# Altium project PCB_Project1.PrjPCB
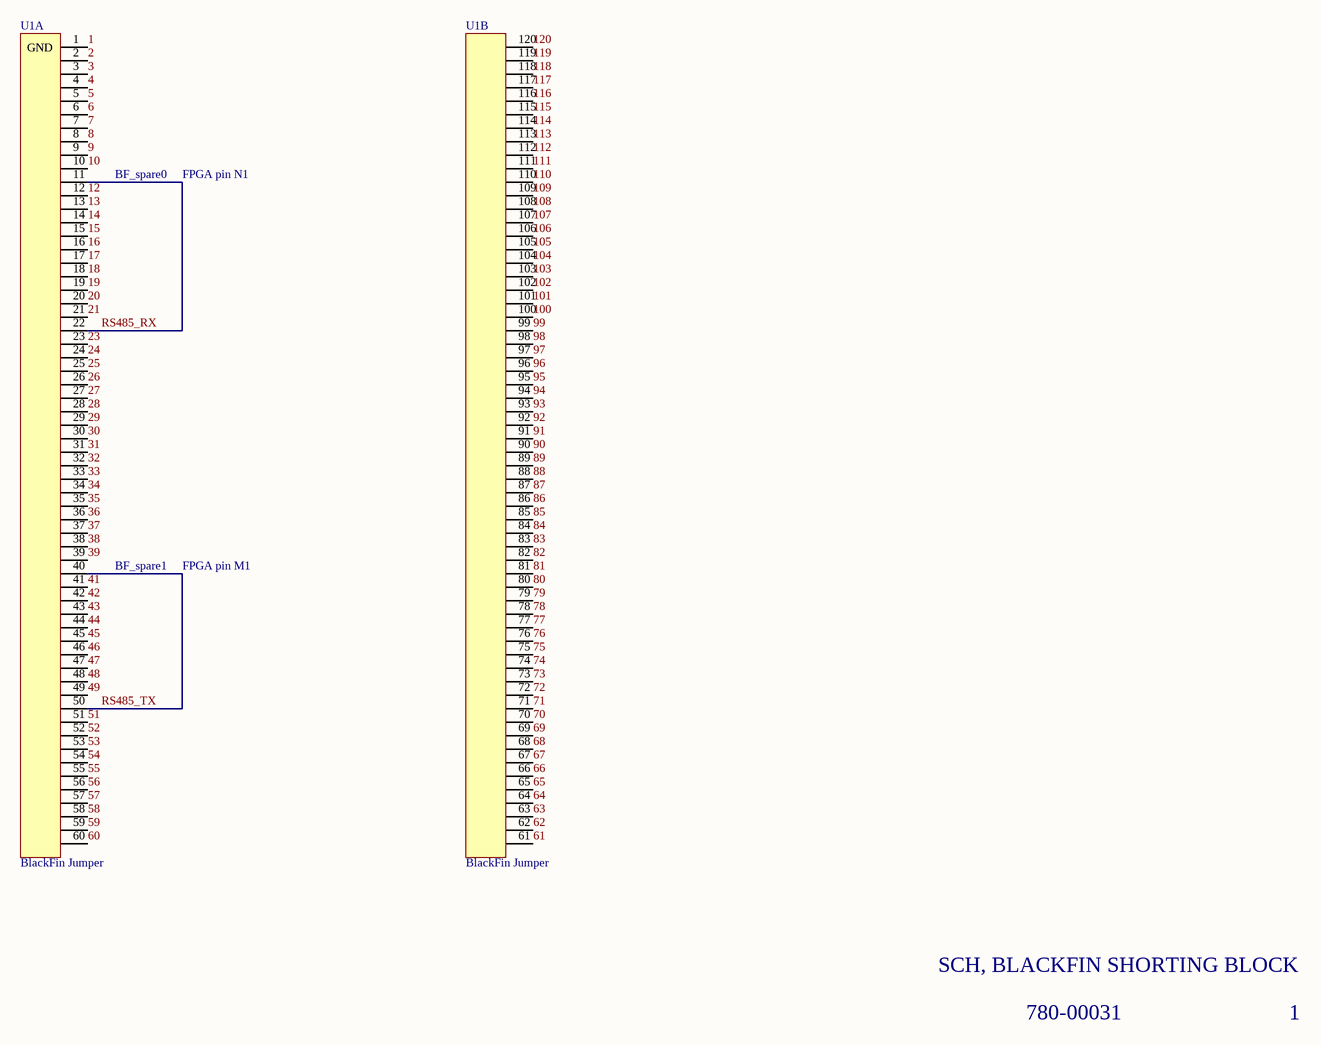
[diagram p0: 780-00031, rev1, BlackFin Shorting Block.SchDoc]
1 sheet, 1 parts. Net scope: global (net labels, ports and power ports of the same name join across sheets).
Board file: 175-00026, rev1, BlackFin Shorting Block.PcbDoc

## Sheet 780-00031, rev1, BlackFin Shorting Block.SchDoc
size B; PageSetup: Record=PageOptions|CenterHorizontal=True|CenterVertical=True|PrintScale=1.09|XCorrection=1.00|YCorrection=1.00|PrintKind=0|BorderSize=5000000|LeftOffset=0|BottomOffset=0|Orientation=2|PaperLength=1000|PaperWidth=1000|Scale=100|PaperSource=7|PrintQuality=-4|MediaType=1|DitherType=10|PaperKind=Tabloid 11 x 17in|PrintScaleMode=1

### Parts
U1  BlackFin Jumper  [CM-BF5xx - Shorting Block]  (parts A,B of 2)

### Nets
1: U1.1(GND)
2: U1.2
3: U1.3
4: U1.4
5: U1.5
6: U1.6
7: U1.7
8: U1.8
9: U1.9
10: U1.10
12: U1.12
13: U1.13
14: U1.14
15: U1.15
16: U1.16
17: U1.17
18: U1.18
19: U1.19
20: U1.20
21: U1.21
23: U1.23
24: U1.24
25: U1.25
26: U1.26
27: U1.27
28: U1.28
29: U1.29
30: U1.30
31: U1.31
32: U1.32
33: U1.33
34: U1.34
35: U1.35
36: U1.36
37: U1.37
38: U1.38
39: U1.39
41: U1.41
42: U1.42
43: U1.43
44: U1.44
45: U1.45
46: U1.46
47: U1.47
48: U1.48
49: U1.49
51: U1.51
52: U1.52
53: U1.53
54: U1.54
55: U1.55
56: U1.56
57: U1.57
58: U1.58
59: U1.59
60: U1.60
61: U1.61
62: U1.62
63: U1.63
64: U1.64
65: U1.65
66: U1.66
67: U1.67
68: U1.68
69: U1.69
70: U1.70
71: U1.71
72: U1.72
73: U1.73
74: U1.74
75: U1.75
76: U1.76
77: U1.77
78: U1.78
79: U1.79
80: U1.80
81: U1.81
82: U1.82
83: U1.83
84: U1.84
85: U1.85
86: U1.86
87: U1.87
88: U1.88
89: U1.89
90: U1.90
91: U1.91
92: U1.92
93: U1.93
94: U1.94
95: U1.95
96: U1.96
97: U1.97
98: U1.98
99: U1.99
100: U1.100
101: U1.101
102: U1.102
103: U1.103
104: U1.104
105: U1.105
106: U1.106
107: U1.107
108: U1.108
109: U1.109
110: U1.110
111: U1.111
112: U1.112
113: U1.113
114: U1.114
115: U1.115
116: U1.116
117: U1.117
118: U1.118
119: U1.119
120: U1.120
RS485_RX: U1.11 U1.22
RS485_TX: U1.40 U1.50

### Notes on the sheet
- BF_spare0
- FPGA pin N1
- BF_spare1
- FPGA pin M1
- SCH, BLACKFIN SHORTING BLOCK
- 780-00031
- 1

### Library data of the parts
U1 = BlackFin Jumper: Jumper to replace BF with shorting block